# EAGLE schematic isd sound primary (EAGLE 9.6.2)
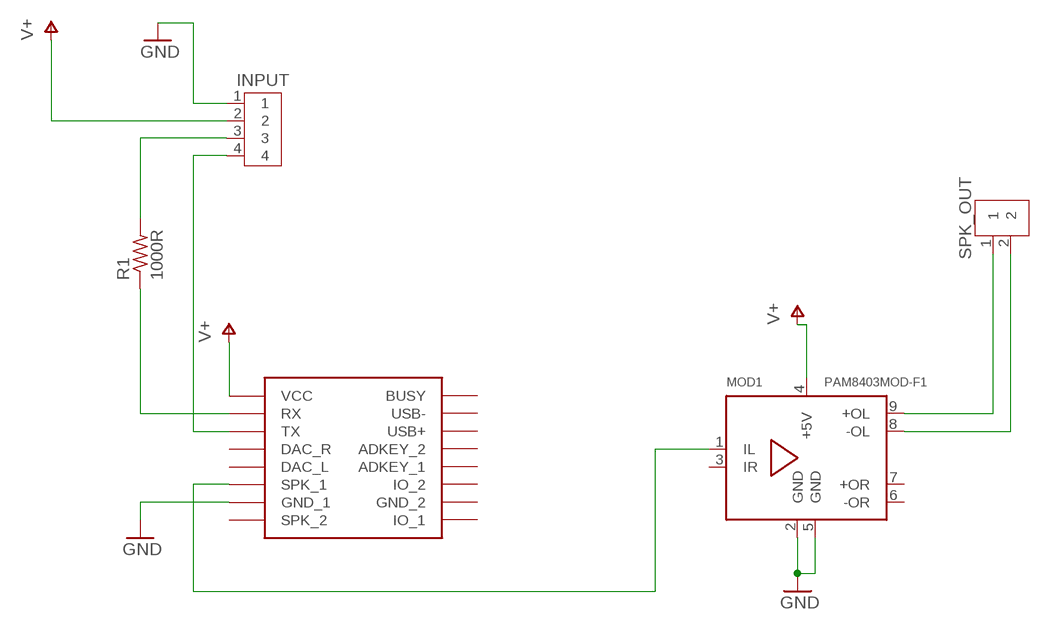
[diagram p0: schematic, sheet 1]

## Parts
INPUT  B4B-XH-A  [B4B-XH-A]
MOD1  PAM8403MOD-F1  [PAM8403MOD1]
R1  1000R  R-US_0204/2V  [0204V]
SPK_OUT  B2B-XH-A  [B2B-XH-A]
U$1  DFPLAYER  [DFPLAYER]

## Nets
GND: INPUT.1 MOD1.2(GND) MOD1.5(GND) U$1.GND_1
N$1: INPUT.3 R1.2
N$2: R1.1 U$1.RX
N$3: INPUT.4 U$1.TX
N$4: MOD1.9(+OL) SPK_OUT.1
N$5: MOD1.8(-OL) SPK_OUT.2
N$6: MOD1.1(IL) U$1.SPK1(SPK_1)
V+: INPUT.2 MOD1.4(+5V) U$1.VCC
Unconnected: MOD1.3(IR) MOD1.6(-OR) MOD1.7(+OR) U$1.ADKEY1(ADKEY_1) U$1.ADKEY2(ADKEY_2) U$1.BUSY U$1.DAC_L U$1.DAC_R U$1.GND_2 U$1.IO1(IO_1) U$1.IO2(IO_2) U$1.SPK2(SPK_2) U$1.USB+ U$1.USB-

## Library data of the parts
INPUT = Connector:B4B-XH-A: XH Connector Top Entry - 4POS Details see: Datasheet <http://www.jst-mfg.com/product/pdf/eng/eXH.pdf>; CATEGORY: CONNECTOR; DSECRIPTION: 2.5mm pitch/disconnctable crimp style connector; MANUFACTURER: JST (XH connector); MPN: B4B-XH-A; OPERATING_TEMPERATURE: -25 C to 85 C; PART_STATUS: ACTIVE; ROHS_COMPLIANT: COMPLAINT; SERIES: B4B-XH-A; SUB_CATEGORY: Through hole; TYPE: TOP ENTRY; VALUE: 3A/250V
MOD1 = dl9sec_public:PAM8403MOD: PAM8403 module 2x3W@4R
R1 = adafruit:R-US_: RESISTOR, American symbol
SPK_OUT = Connector:B2B-XH-A: XH Connector Top Entry - 2POS Details see: Datasheet <http://www.jst-mfg.com/product/pdf/eng/eXH.pdf>; CATEGORY: CONNECTOR; DESCRIPTION: 2.5mm pitch/disconnectable crimp style connector; MANUFACTURER: JST (XH CONNECTOR); MPN: B2B-XH-A; OPERATING_TEMPERATURE: -25°C ~ 85°C; PART_STATUS: ACTIVE; ROHS_COMPLIANT: COMPLIANT; SERIES: B_B-XH-A; SUB_CATEGORY: Through hole connector; TYPE: top entry; VALUE: 3A/250V
U$1 = DFPlayer_v1:DFPLAYER